# Altium schematic sheet UI-connector.SchDoc
size A4; SheetNumber: 14; SheetTotal: 14
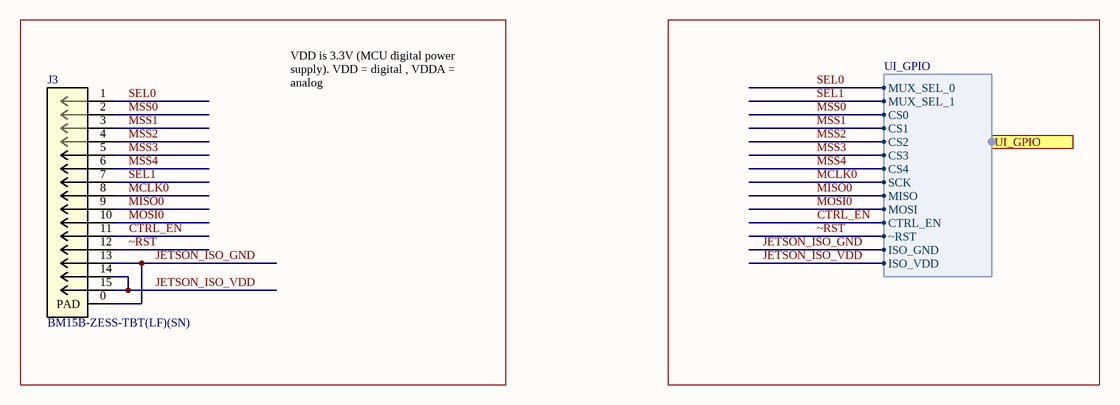
[diagram p0: UI-connector.SchDoc]

## Parts
J3  BM15B-ZESS-TBT(LF)(SN)  [JST ZE SMT 15POS]

## Ports
UI_GPIO (in, harness UI_GPIO)

## Harnesses
UI_GPIO: MUX_SEL_0, MUX_SEL_1, CS0, CS1, CS2, CS3, CS4, SCK, MISO, MOSI, CTRL_EN, ~RST, ISO_GND, ISO_VDD

## Nets
CTRL_EN: J3.11 ; port UI_GPIO.CTRL_EN
JETSON_ISO_GND: J3.0(PAD) J3.13 ; port UI_GPIO.ISO_GND
JETSON_ISO_VDD: J3.14 J3.15 ; port UI_GPIO.ISO_VDD
~{MSS}0: J3.2 ; port UI_GPIO.CS0
~{MSS}1: J3.3 ; port UI_GPIO.CS1
~{MSS}2: J3.4 ; port UI_GPIO.CS2
~{MSS}3: J3.5 ; port UI_GPIO.CS3
~{MSS}4: J3.6 ; port UI_GPIO.CS4
MCLK0: J3.8 ; port UI_GPIO.SCK
MISO0: J3.9 ; port UI_GPIO.MISO
MOSI0: J3.10 ; port UI_GPIO.MOSI
SEL0: J3.1 ; port UI_GPIO.MUX_SEL_0
SEL1: J3.7 ; port UI_GPIO.MUX_SEL_1
~RST: J3.12 ; port UI_GPIO.~RST

## Notes on the sheet
- VDD is 3.3V (MCU digital power supply). VDD = digital , VDDA = analog

## Library data of the parts
J3 = CN 15POS JST ZE SMT: CONN HEADER VERT SMD 15POS ZE; Supplier 1: Digi-Key; Supplier Part Number 1: 455-4211-1-ND; Part Number: CN 15POS JST ZE SMT; Manufacturer Part Number: BM15B-ZESS-TBT(LF)(SN); Supplier URL 1: https://www.digikey.ca/en/products/detail/jst-sales-america-inc/BM15B-ZESS-TBT-LF-SN/1886999?s=N4IgTCBcDaIEIFkCMBWOBaAWgUQMq-QBU5CAKAGQDEBKU3AOWpAF0BfIA; Pin Count: 15